# Altium schematic sheet Power_sch.SchDoc
size A; SheetNumber: 2; SheetTotal: 2
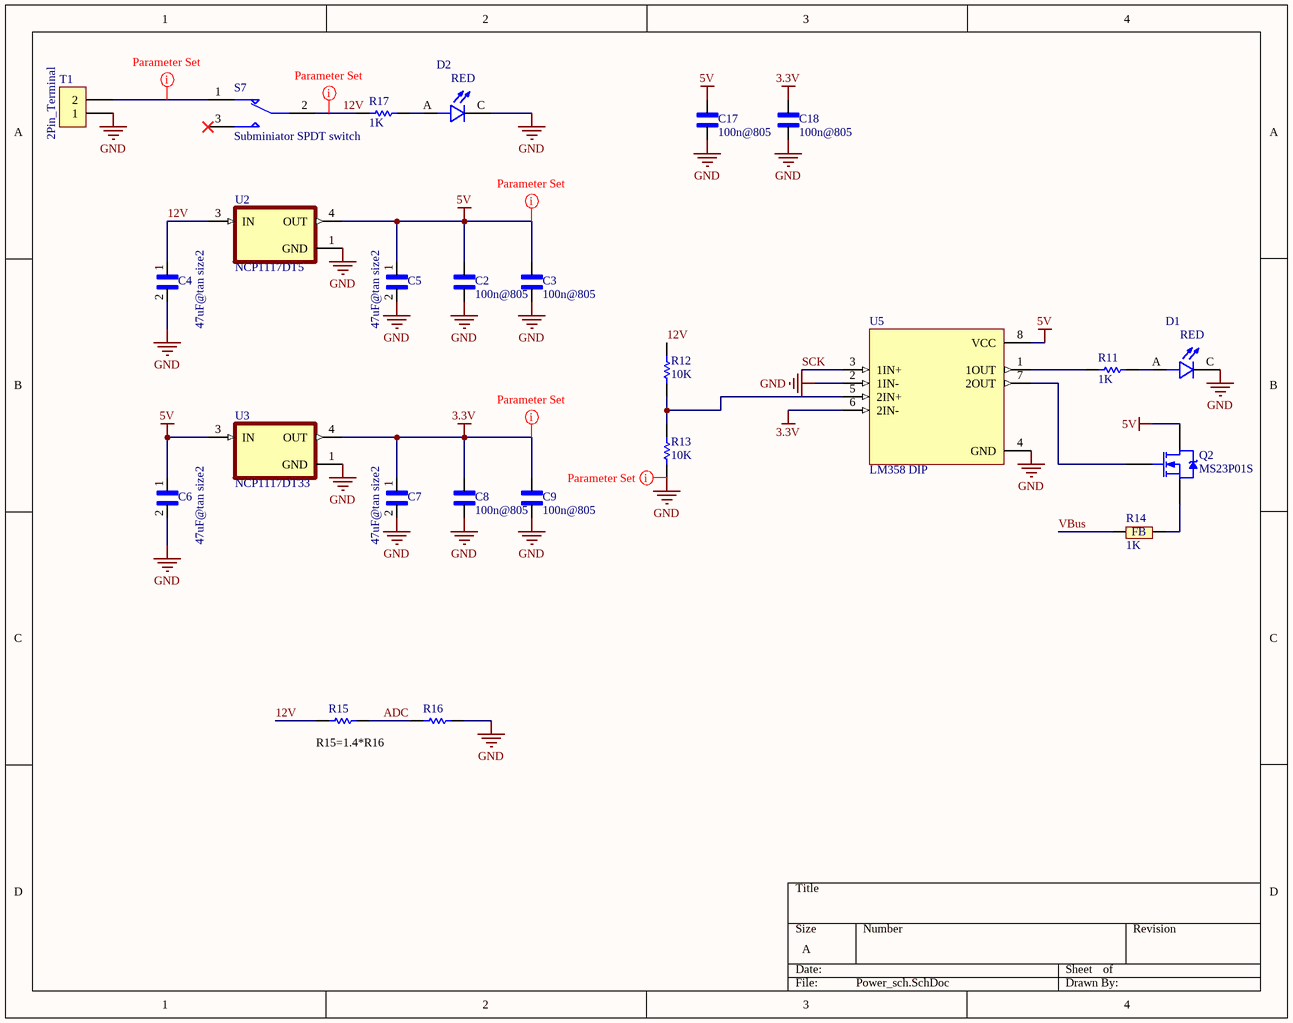
[diagram p0: Power_sch.SchDoc]

## Parts
C2  100n@805  [CAPC2012X95N]
C3  100n@805  [CAPC2012X95N]
C4  47uF@tan size2  [CAPC2012X140N]
C5  47uF@tan size2  [CAPC2012X140N]
C6  47uF@tan size2  [CAPC2012X140N]
C7  47uF@tan size2  [CAPC2012X140N]
C8  100n@805  [CAPC2012X95N]
C9  100n@805  [CAPC2012X95N]
C17  100n@805  [CAPC2012X95N]
C18  100n@805  [CAPC2012X95N]
D1  7012X1  [LED_7012X1]  (value not drawn)
D2  7012X1  [LED_7012X1]  (value not drawn)
Q2  MS23P01S  [IRF640N TO-220AB]
R11  1K  [RES0805]
R12  10K  [RES0805]
R13  10K  [RES0805]
R14  1K  [RES0805]
R15  2.2K  [RES0805]  (value not drawn)
R16  10K  [RES0805]  (value not drawn)
R17  1K  [RES0805]
S7  Subminiator SPDT switch  [Subminiator SPDT switch]
T1  2Pin_Terminal  [2Pin_Terminal]
U2  NCP1117DT5  [VREG_NCP1117DT33]
U3  NCP1117DT33  [VREG_NCP1117DT33]
U5  LM358 DIP  [LM358 DIP]

## Nets
3.3V: C7.1 C8.2 C9.2 C18.2 U3.4(OUT) U5.6(2IN-)
5V: C2.2 C3.2 C5.1 C6.1 C17.2 Q2.3(D) U2.4(OUT) U3.3(IN) U5.8(VCC)
GND: C2.1 C3.1 C4.2 C5.2 C6.2 C7.2 C8.1 C9.1 C17.1 C18.1 D1.C D2.C R13.1 R16.1 T1.1 U2.1(GND) U3.1(GND) U5.2(1IN-) U5.4(GND)
12V: C4.1 R12.2 R15.2 R17.2 S7.2 U2.3(IN)
ADC: R15.1 R16.2
SCK: U5.3(1IN+)
VBus: R14.1
NetD1_A: D1.A R11.1
NetD2_A: D2.A R17.1
NetQ2_1: Q2.1(G) U5.7(2OUT)
NetQ2_2: Q2.2(S) R14.2
NetR11_2: R11.2 U5.1(1OUT)
NetR12_1: R12.1 R13.2 U5.5(2IN+)
NetS7_1: S7.1 T1.2

Not connected (* = marked no-connect by the designer): S7 3*

## Layout directives
rule Width Constraint [Pref Width = 0.5mm    Min Width = 0.4mm    Max Width = 0.6mm]: 3.3V, 5V, 12V, GND, NetS7_1

## Notes on the sheet
- (near R15) R15=1.4*R16
- (in symbol 7012X1) RED
- (in symbol RES1206) FB

## Library data of the parts
C2 C3 C8 C9 C17 C18 = AC0805KPX7R9BB103: Multilayer Ceramic Capacitors MLCC - SMD/SMT 50Vol 0.01uF X7R 805 10% AEC-Q200; MF: YAGEO; SnapEDA_Link: https://www.snapeda.com/parts/AC0805KPX7R9BB103/Yageo/view-part/?ref=snap; Package: 0805 Yageo; Value: *; MP: AC0805KPX7R9BB103; Check_prices: https://www.snapeda.com/parts/AC0805KPX7R9BB103/Yageo/view-part/?ref=eda
C4-C7 = TLJR476M010S3200: Tantalum Capacitors; MF: AVX; Price: None; Availability: Unavailable; Value: *; MP: TLJR476M010S3200; Check_prices: https://www.snapeda.com/parts/TLJR476M010S3200/AVX/view-part/1709907/?ref=eda; SnapEDA_Link: https://www.snapeda.com/parts/TLJR476M010S3200/AVX/view-part/1709907/?ref=snap; Package: 0805 AVX
D1 D2 = 7012X1: Red - LED Indication - Discrete 1.7V 0805 (2012 Metric); MF: VCC; Package: 0805 Visual Communications; Purchase-URL: https://pricing.snapeda.com/search/part/7012X1/?ref=eda; MP: 7012X1; Value: *; Availability: In Stock; SnapEDA_Link: https://www.snapeda.com/parts/7012X1/Visual+Communications/view-part/?ref=snap; Price: None; Check_prices: https://www.snapeda.com/parts/7012X1/Visual+Communications/view-part/?ref=eda
Q2 = IRF640N
R11-R13 R15-R17 = RES0805
R14 = RES1206
U2 U3 = NCP1117DT33: Linear Voltage Regulator IC Positive Fixed 1 Output 1A DPAK; MF: ON Semiconductor; Price: None; Value: *; Availability: In Stock; Check_prices: https://www.snapeda.com/parts/NCP1117DT33/Onsemi/view-part/?ref=eda; SnapEDA_Link: https://www.snapeda.com/parts/NCP1117DT33/Onsemi/view-part/?ref=snap; Purchase-URL: https://pricing.snapeda.com/search/part/NCP1117DT33/?ref=eda; MP: NCP1117DT33; Package: DPAK-3 ON Semiconductor
U5 = LM358 DIP: Dual Operational Amplifiers; MP: LM358P; MF: Texas Instruments; Package: PDIP-8 Texas Instruments; DigiKey-Purchase-URL: https://snapeda.com/shop?store=DigiKey&id=559457; Arrow_Electronics-Purchase-URL: https://snapeda.com/shop?store=Arrow+Electronics&id=559457; Price: None; Texas_Instruments-Purchase-URL: https://snapeda.com/shop?store=Texas+Instruments&id=559457; Value: *; Availability: Unavailable; SnapEDA_Link: https://www.snapeda.com/parts/LM358P/Texas%20Instruments/view-part/559457/?ref=snap; Mouser-Purchase-URL: https://snapeda.com/shop?store=Mouser&id=559457